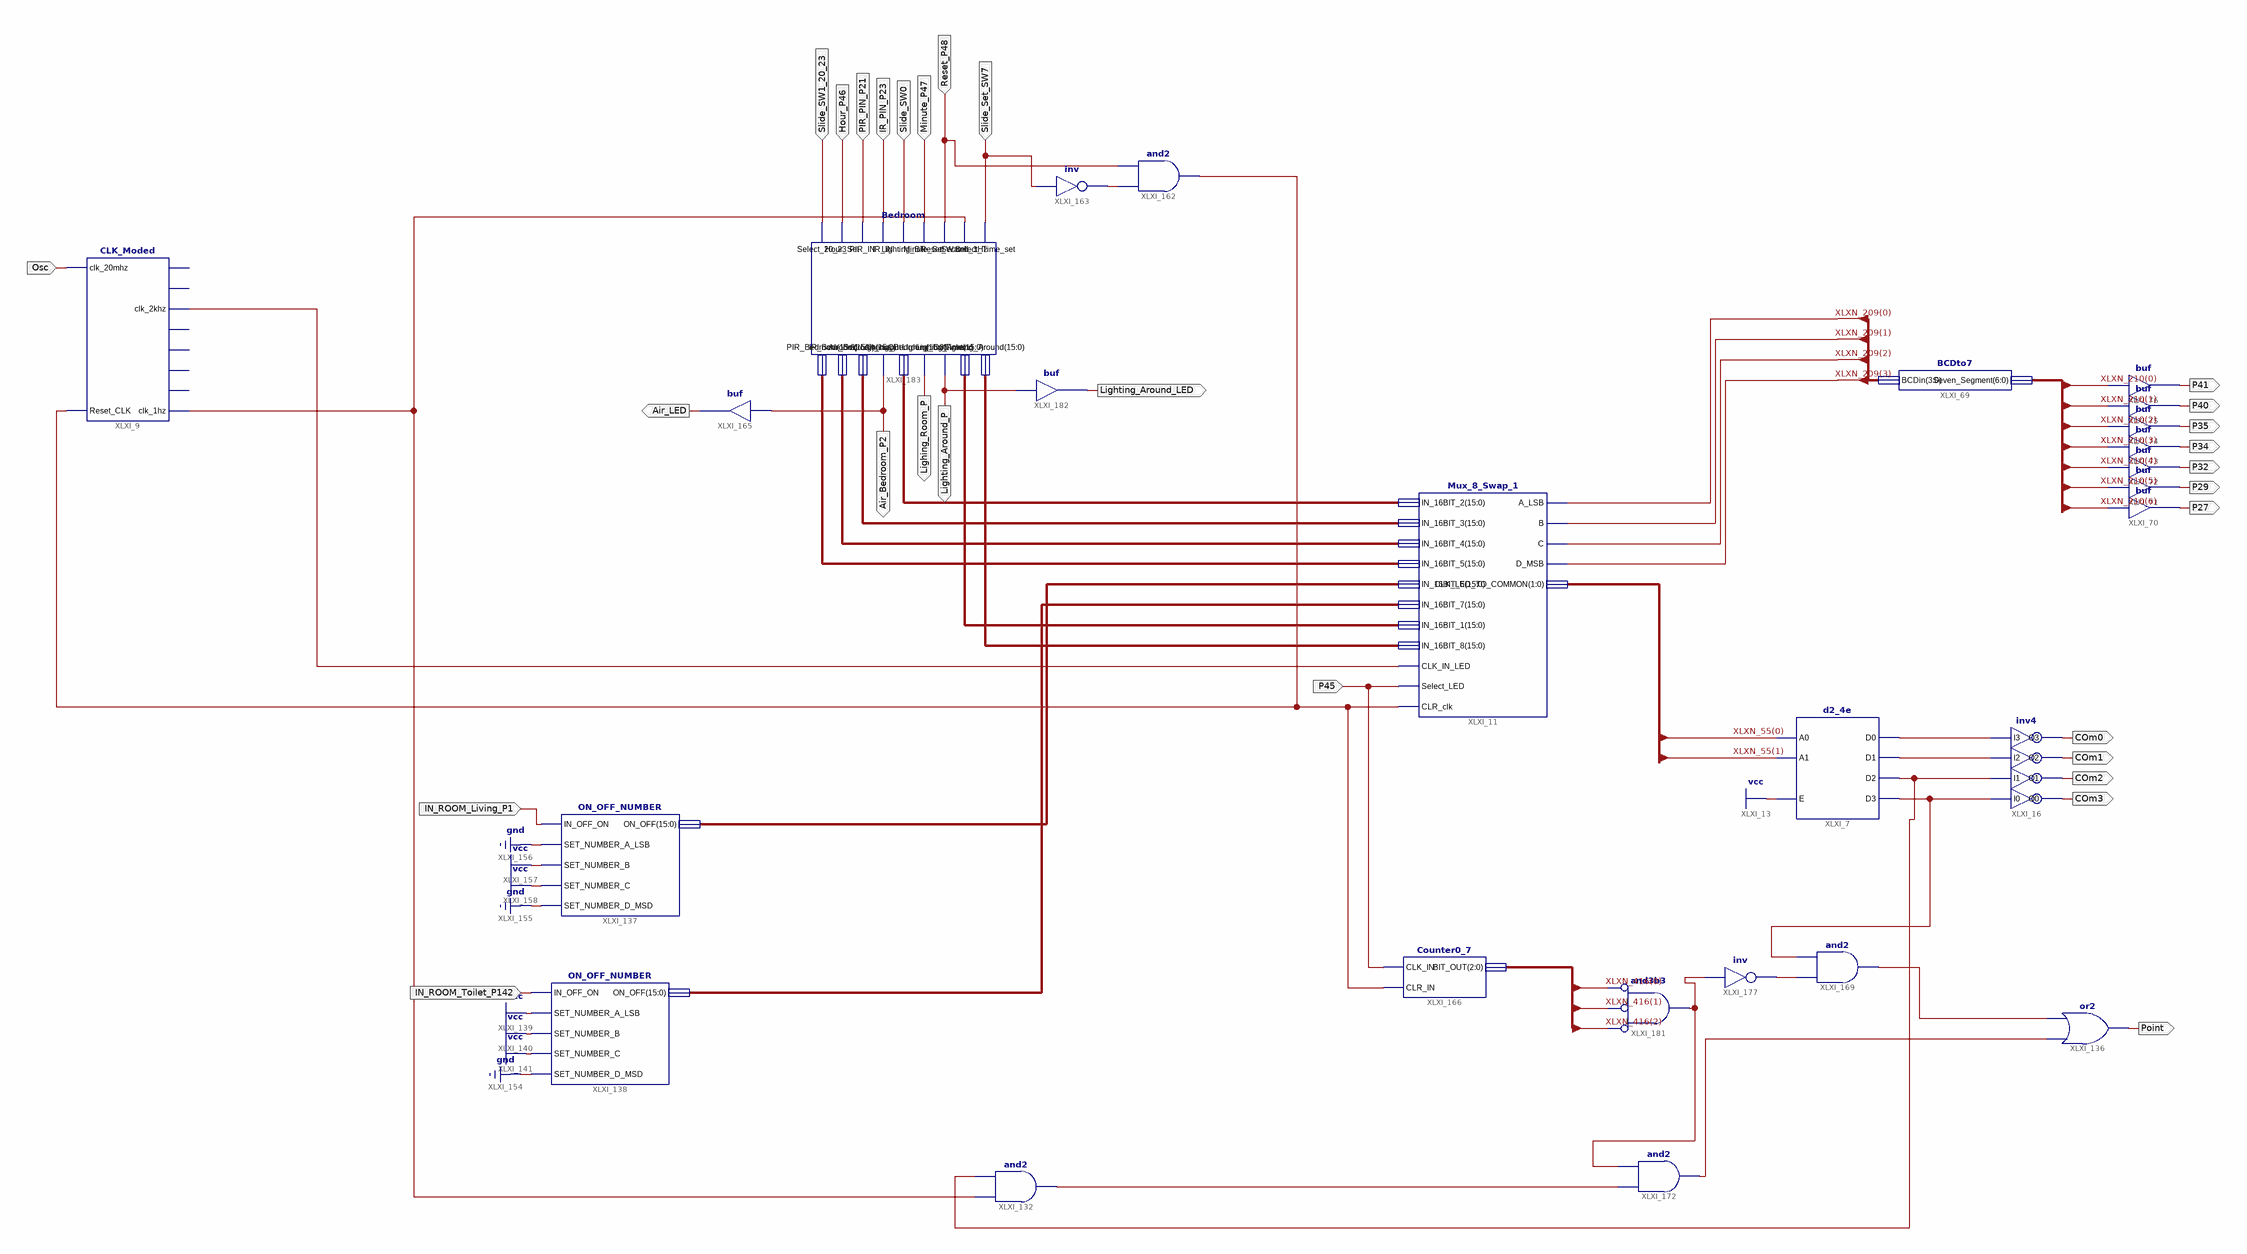
[diagram p0: schematic sheet 1]
// Xilinx ISE schematic Main_Module.sch (spartan6) as structural Verilog: 26 symbols, 29 ports
module Main_Module (
  input  Osc,
  input  P45,
  input  Slide_Set_SW7,
  input  Reset_P48,
  input  Minute_P47,
  input  Slide_SW0,
  input  IR_PIN_P23,
  input  PIR_PIN_P21,
  input  Hour_P46,
  input  Slide_SW1_20_23,
  input  IN_ROOM_Living_P1,
  input  IN_ROOM_Toilet_P142,
  output COm0,
  output COm1,
  output COm2,
  output P27,
  output P29,
  output P32,
  output P34,
  output P35,
  output P40,
  output P41,
  output COm3,
  output Lighting_Around_P,
  output Lighing_Room_P,
  output Air_Bedroom_P2,
  output Air_LED,
  output Point,
  output Lighting_Around_LED
);

  wire XLXN_90, XLXN_91, XLXN_98, XLXN_340, XLXN_393, XLXN_414, XLXN_422, XLXN_423, XLXN_432, XLXN_447,
       XLXN_449, XLXN_450, XLXN_458;
  wire [1:0] XLXN_55;
  wire [2:0] XLXN_416;
  wire [3:0] XLXN_209;
  wire [6:0] XLXN_210;
  wire [15:0] XLXN_371, XLXN_372, XLXN_405, XLXN_406, XLXN_407, XLXN_408, XLXN_409, XLXN_410;

  d2_4e XLXI_7 (.A0(XLXN_55[0]), .A1(XLXN_55[1]), .E(1'b1), .D0(XLXN_90), .D1(XLXN_91), .D2(XLXN_422), .D3(XLXN_423));
  Mux_8_Swap_1 XLXI_11 (
    .A_LSB(XLXN_209[0]), .B(XLXN_209[1]), .C(XLXN_209[2]), .CLK_IN_LED(XLXN_98), .CLK_LED_TO_COMMON(XLXN_55),
    .CLR_clk(XLXN_414), .D_MSB(XLXN_209[3]), .IN_16BIT_1(XLXN_406), .IN_16BIT_2(XLXN_407),
    .IN_16BIT_3(XLXN_408), .IN_16BIT_4(XLXN_409), .IN_16BIT_5(XLXN_410), .IN_16BIT_6(XLXN_371),
    .IN_16BIT_7(XLXN_372), .IN_16BIT_8(XLXN_405), .Select_LED(P45));
  inv4 XLXI_16 (.I0(XLXN_423), .I1(XLXN_422), .I2(XLXN_91), .I3(XLXN_90), .O0(COm3), .O1(COm2), .O2(COm1), .O3(COm0));
  CLK_Moded XLXI_9 (
    .clk_20mhz(Osc), .Reset_CLK(XLXN_414), .clk_2khz(XLXN_98), .clk_1hz(XLXN_340));  // open: clk_2mhz, clk_200khz, clk_200hz, clk_2hz, clk_20khz, clk_20hz
  BCDto7 XLXI_69 (.BCDin(XLXN_209), .Seven_Segment(XLXN_210));
  buf XLXI_70 (P27, XLXN_210[6]);
  buf XLXI_71 (P29, XLXN_210[5]);
  buf XLXI_72 (P32, XLXN_210[4]);
  buf XLXI_73 (P34, XLXN_210[3]);
  buf XLXI_74 (P35, XLXN_210[2]);
  buf XLXI_75 (P40, XLXN_210[1]);
  buf XLXI_76 (P41, XLXN_210[0]);
  and XLXI_132 (XLXN_432, XLXN_340, XLXN_422);
  ON_OFF_NUMBER XLXI_137 (
    .IN_OFF_ON(IN_ROOM_Living_P1), .ON_OFF(XLXN_371), .SET_NUMBER_A_LSB(1'b0), .SET_NUMBER_B(1'b1),
    .SET_NUMBER_C(1'b1), .SET_NUMBER_D_MSD(1'b0));
  ON_OFF_NUMBER XLXI_138 (
    .IN_OFF_ON(IN_ROOM_Toilet_P142), .ON_OFF(XLXN_372), .SET_NUMBER_A_LSB(1'b1), .SET_NUMBER_B(1'b1),
    .SET_NUMBER_C(1'b1), .SET_NUMBER_D_MSD(1'b0));
  and XLXI_162 (XLXN_414, XLXN_393, Reset_P48);
  not XLXI_163 (XLXN_393, Slide_Set_SW7);
  buf XLXI_165 (Air_LED, Air_Bedroom_P2);
  Counter0_7 XLXI_166 (.CLK_IN(P45), .CLR_IN(XLXN_414), .BIT_OUT(XLXN_416));
  and XLXI_169 (XLXN_458, XLXN_449, XLXN_423);
  and XLXI_172 (XLXN_447, XLXN_432, XLXN_450);
  not XLXI_177 (XLXN_449, XLXN_450);
  or XLXI_136 (Point, XLXN_447, XLXN_458);
  and XLXI_181 (XLXN_450, ~XLXN_416[2], ~XLXN_416[1], ~XLXN_416[0]);  // and3b3
  buf XLXI_182 (Lighting_Around_LED, Lighting_Around_P);
  Bedroom XLXI_183 (
    .Air_Bedroom(XLXN_408), .Air_output(Air_Bedroom_P2), .Hour_Set(Hour_P46), .IR_Bedroom(XLXN_409),
    .IR_IN(IR_PIN_P23), .Lighing_Around(Lighting_Around_P), .Lighing_Out(Lighing_Room_P),
    .Lighting_Around(XLXN_405), .Lighting_Bedroom(XLXN_407), .Lighting_BT(Slide_SW0),
    .Minute_Set(Minute_P47), .PIR_Bedroom(XLXN_410), .PIR_IN(PIR_PIN_P21), .Reset_Watch(Reset_P48),
    .Second_1Hz(XLXN_340), .Select_20_23(Slide_SW1_20_23), .Select_Time_set(Slide_Set_SW7), .Time(XLXN_406));
endmodule
